# EAGLE design drv (EAGLE 9.1.0)
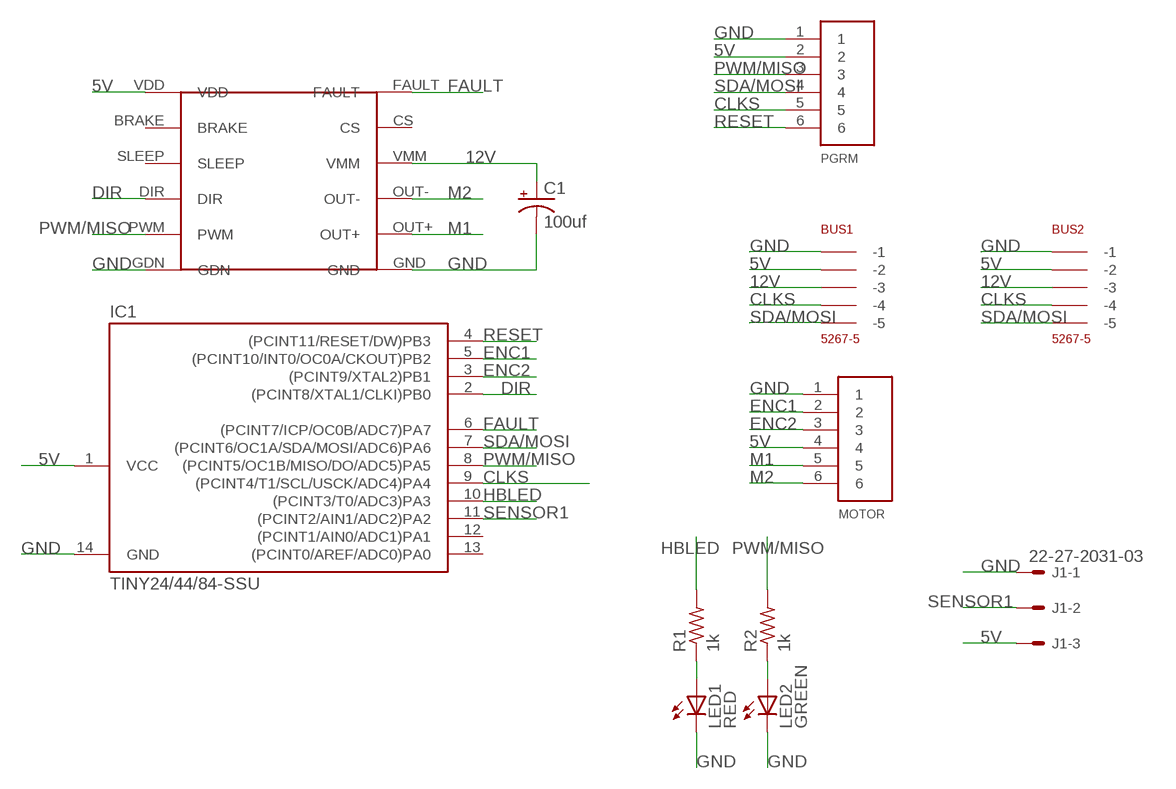
[diagram p0: schematic, sheet 1]

## Parts
BUS1  5267-5  [5267-5]
BUS2  5267-5  [5267-5]
C1  100uf  CPOL-USE5-10.5  [E5-10,5]
IC1  TINY24/44/84-SSU  [SOIC14]
J1  22-27-2031-03  [6410-03]
LED1  RED  LEDSMT1206  [1206]
LED2  GREEN  LEDSMT1206  [1206]
MOTOR  6PIN  [B6B-PH-K-S]
PGRM  6PIN  [B6B-PH-K-S]
R1  1k  R-US_M1206  [M1206]
R2  1k  R-US_M1206  [M1206]
U$1  DRV8801BR  [DRV8801BR]

## Nets
5V [pwr]: BUS1.P$2(-2) BUS2.P$2(-2) IC1.1(VCC) J1.3 MOTOR.4 PGRM.2 U$1.VDD
12V [pwr]: BUS1.P$3(-3) BUS2.P$3(-3) C1.+ U$1.VMM
CLKS: BUS1.P$4(-4) BUS2.P$4(-4) IC1.9((PCINT4/T1/SCL/USCK/ADC4)PA4) PGRM.5
DIR: IC1.2((PCINT8/XTAL1/CLKI)PB0) U$1.DIR
ENC1: IC1.5((PCINT10/INT0/OC0A/CKOUT)PB2) MOTOR.2
ENC2: IC1.3((PCINT9/XTAL2)PB1) MOTOR.3
FAULT: IC1.6((PCINT7/ICP/OC0B/ADC7)PA7) U$1.FAULT
GND [pwr]: BUS1.P$1(-1) BUS2.P$1(-1) C1.- IC1.14(GND) J1.1 LED1.C LED2.C MOTOR.1 PGRM.1 U$1.GDN U$1.GND
HBLED: IC1.10((PCINT3/T0/ADC3)PA3) R1.2
M1 [pwr]: MOTOR.5 U$1.OUT+
M2 [pwr]: MOTOR.6 U$1.OUT-
N$6: LED1.A R1.1
N$7: LED2.A R2.1
PWM/MISO: IC1.8((PCINT5/OC1B/MISO/DO/ADC5)PA5) PGRM.3 R2.2 U$1.PWM
RESET: IC1.4((PCINT11/RESET/DW)PB3) PGRM.6
SDA/MOSI: BUS1.P$5(-5) BUS2.P$5(-5) IC1.7((PCINT6/OC1A/SDA/MOSI/ADC6)PA6) PGRM.4
SENSOR1: IC1.11((PCINT2/AIN1/ADC2)PA2) J1.2
Unconnected: IC1.12((PCINT1/AIN0/ADC1)PA1) IC1.13((PCINT0/AREF/ADC0)PA0) U$1.BRAKE U$1.CS U$1.SLEEP

## Library data of the parts
BUS1 BUS2 = con-molex-spox:5267-5
C1 = rcl:CPOL-US: POLARIZED CAPACITOR, American symbol; SPICEPREFIX: C
IC1 = avr-7:TINY24/44/84
J1 = con-molex:22-?-03: CONNECTOR wire to board 2.54 mm (.1 inch) pitch header; MF: MOLEX; OC_FARNELL: unknown; OC_NEWARK: unknown
LED1 LED2 = led:LED: LED OSRAM: - CHIPLED LG R971, LG N971, LY N971, LG Q971, LY Q971, LO R971, LY R971 LH N974, LH R974 LS Q976, LO Q976, LY Q976 LO Q996 - Hyper CHIPLED LW Q18S LB Q993, LB Q99A, LB R99A - SideLED LS A670, LO A670, LY A670, LG A670, LP A670 LB A673, LV A673, LT A673, LW A673 LH A674 LY A675 LS A676, LA A676, LO A676, LY A676, LW A676 LS A679, LY A679, LG A679 - Hyper Micro SIDELED® LS Y876, LA Y876, LO Y876, LY Y876 LT Y87S - SmartLED LW L88C, LW L88S LB L89C, LB L89S, LG L890 LS L89K, LO L89K, LY L89K LS L896, LA L896, LO L896, LY L896 - TOPLED LS T670, LO T670, LY T670, LG T670, LP T670 LSG T670, LSP T670, LSY T670, LOP T670, LYG T670 LG T671, LOG T671, LSG T671 LB T673, LV T673, LT T673, LW T673 LH T674 LS T676, LA T676, LO T676, LY T676, LB T676, LH T676, LSB T676, LW T676 LB T67C, LV T67C, LT T67C, LS T67K, LO T67K, LY T67K, LW E67C LS E67B, LA E67B, LO E67B, LY E67B, LB E67C, LV E67C, LT E67C LW T67C LS T679, LY T679, LG T679 LS T770, LO T770, LY T770, LG T770, LP T770 LB T773, LV T773, LT T773, LW T773 LH T774 LS E675, LA E675, LY E675, LS T675 LS T776, LA T776, LO T776, LY T776, LB T776 LHGB T686 LT T68C, LB T68C - Hyper Mini TOPLED® LB M676 - Mini TOPLED Santana® LG M470 LS M47K, LO M47K, LY M47K Source: http://www.osram.convergy.de LUXEON: - LUMILED® LXK2-PW12-R00, LXK2-PW12-S00, LXK2-PW14-U00, LXK2-PW14-V00 LXK2-PM12-R00, LXK2-PM12-S00, LXK2-PM14-U00 LXK2-PE12-Q00, LXK2-PE12-R00, LXK2-PE12-S00, LXK2-PE14-T00, LXK2-PE14-U00 LXK2-PB12-K00, LXK2-PB12-L00, LXK2-PB12-M00, LXK2-PB14-N00, LXK2-PB14-P00, LXK2-PB14-Q00 LXK2-PR12-L00, LXK2-PR12-M00, LXK2-PR14-Q00, LXK2-PR14-R00 LXK2-PD12-Q00, LXK2-PD12-R00, LXK2-PD12-S00 LXK2-PH12-R00, LXK2-PH12-S00 LXK2-PL12-P00, LXK2-PL12-Q00, LXK2-PL12-R00 Source: www.luxeon.com KINGBRIGHT: KA-3528ASYC Source: www.kingbright.com
MOTOR PGRM = jst_eph:6PIN
R1 R2 = rcl:R-US_: RESISTOR, American symbol; SPICEPREFIX: R
U$1 = pololu:DRV8801BR

## Net classes
0 default: width 0.2 mm, clearance 0.1 mm
1 pwr: width 1 mm, clearance 0.25 mm
2 5v: width 0.4 mm, clearance 0.2 mm

## Board
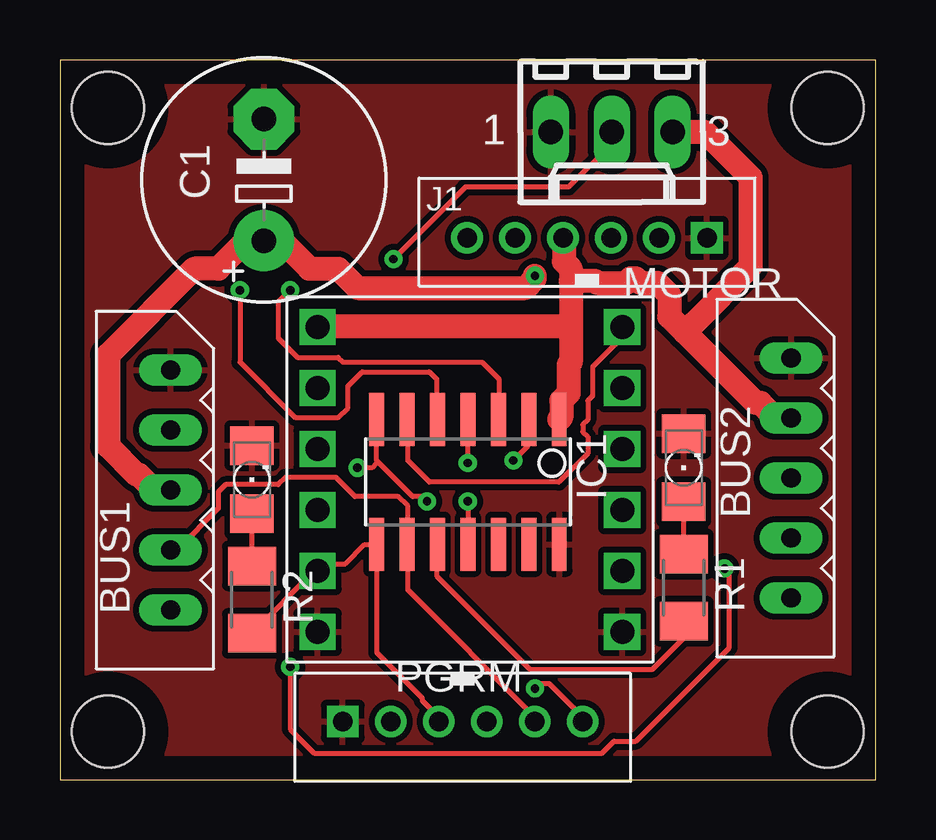
[diagram p1: board, top side]
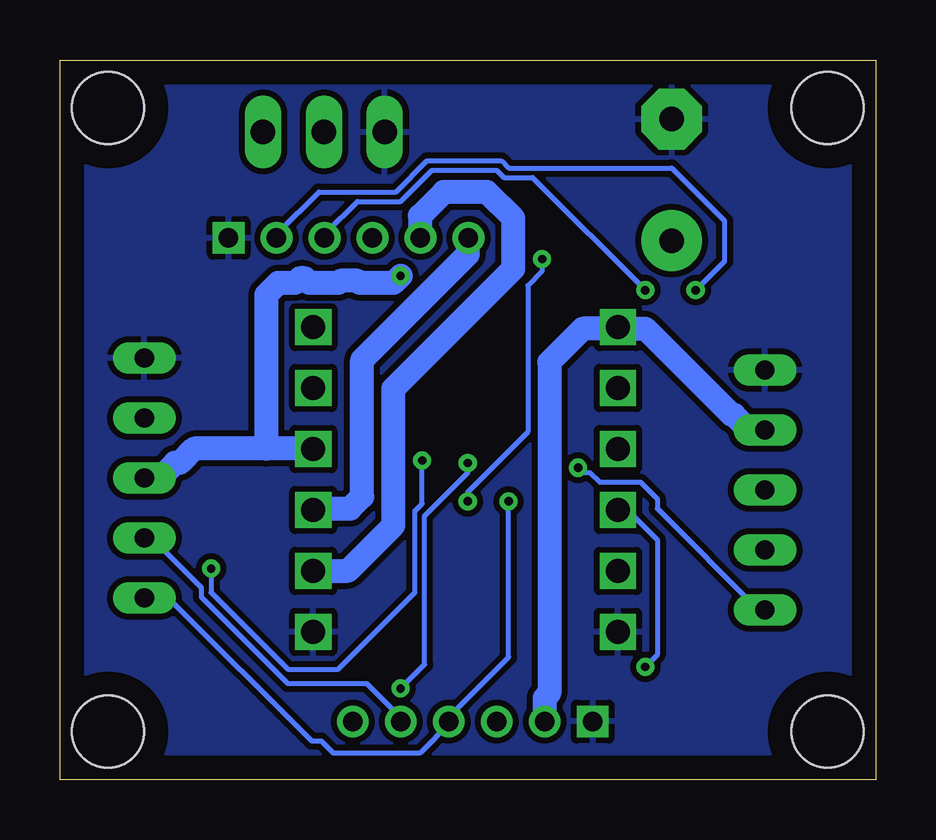
[diagram p2: board, bottom side, seen from below]

Size 34 x 30 mm. Coordinates in mm from the lower left corner, seen from the top.
Outline: 0,0 34,0 34,30 0,30 0,0
Copper layers (1*16): Top 0.035mm / dielectric 1.5mm / Bottom 0.035mm
Design rules "default *": minimum track width 6mil, minimum drill 0.35mm, track to track 0.2mm, track to pad 0.3mm, pad to pad 0.3mm, via to via 0.3mm, smd to smd 0.2mm, copper to edge 1mm, drill to drill 0.5mm, minimum pad ring 10mil, minimum via ring 8mil, stop-mask expansion 4mil, vias tented up to drill 0mil, thermal gap 10mil
Holes 3 mm at 2,2 2,28 32,2 32,28

### Footprints (pad centres in the part's own frame; a part is rotated, then mirrored left to right if it is on the bottom)
5267-5 = drill 0.8 long: P$1 0,0; P$2 2.5,0; P$3 5,0; P$4 7.5,0; P$5 10,0
E5-10,5 = drill 1.016 pad 2.54: + -2.54,0 | drill 1.016 pad 2.54 octagon: - 2.54,0
SOIC14 = smd 0.61 x 2.21: 1 -3.81,-2.603; 2 -2.54,-2.603; 3 -1.27,-2.603; 4 0,-2.603; 5 1.27,-2.603; 6 2.54,-2.603; 7 3.81,-2.603; 8 3.81,2.603; 9 2.54,2.603; 10 1.27,2.603; 11 0,2.603; 12 -1.27,2.603; 13 -2.54,2.603; 14 -3.81,2.603
6410-03 = drill 1.016 long: 1 2.54,0; 2 0,0; 3 -2.54,0
1206 = smd 1.6 x 1.803: A -1.422,0; C 1.422,0
B6B-PH-K-S = drill 0.813 square: 1 5,0 | drill 0.813: 2 3,0; 3 1,0; 4 -1,0; 5 -3,0; 6 -5,0
M1206 = smd 1.6 x 2: 1 -1.4,0; 2 1.4,0
DRV8801BR = drill 1 square: BRAKE 1.27,11.43; CS 13.97,11.43; DIR 1.27,6.35; FAULT 13.97,13.97; GDN 1.27,1.27; GND 13.97,1.27; OUT+ 13.97,3.81; OUT- 13.97,6.35; PWM 1.27,3.81; SLEEP 1.27,8.89; VDD 1.27,13.97; VMM 13.97,8.89

### Placement (x,y rotation side)
BUS1  4.61,17.07 270 top
BUS2  30.48,17.57 270 top
C1  8.5,25 90 top
IC1  17.01,12.41 180 top
J1  23,27 180 top
LED1  26,13 90 top
LED2  8,12.5 90 top
MOTOR  21.97,22.58 0 top
PGRM  16.79,2.42 180 top
R1  26,8 270 top
R2  8,7.5 270 top
U$1  9.47,4.89 0 top

### Tracks (layer width: path | path; a pad name or v marks a point on that pad's centre or on a via)
5V
  Top 1: 21.3,20.8 21.3,21.3 21,21.6 21,22.5 MOTOR.4 | 21.3,20.8 21.3,18.9 | 21.3,18.9 21.3,17.4 21.2,17.3 21.2,16.1 20.9,15.8 20.9,15.1 IC1.1 | 26.05,18.65 25.4,19.3 25.4,20.2 24.9,20.7 24.2,20.7 24,20.9 23.8,20.9 23.6,20.7 22.4,20.7 22.3,20.8 21.7,20.8 21.3,20.8 | 26.05,18.65 29,15.7 29.2,15.7 29.8,15.1 30.4,15.1 BUS2.P$2 | J1.3 25.6,27 26.9,27 28.8,25.1 28.8,21.4 26.4,19 26.05,18.65 | 21.3,18.9 20.9,18.9 10.8,18.9 U$1.VDD
  Bottom 1: BUS1.P$2 4.7,14.6 5.3,14.6 5.9,15.2 6,15.2 9.6,18.8 10.7,18.8 U$1.VDD 11.2,18.8 12.2,18.8 13.6,17.4 13.6,3.6 13.8,3.4 13.8,2.5 PGRM.2
12V  (via drill 0.35)
  Top 1: BUS1.P$3 4.6,12.1 3.9,12.1 3.3,12.7 3.2,12.7 2,13.9 2,17.7 5.6,21.3 6.6,21.3 7.7,22.4 8.5,22.4 C1.+ 8.9,22.3 9.4,22.3 10.4,21.3 11.6,21.3 12.4,20.5 19.4,20.5 19.8,20.9 v19.8,21
  Bottom 1: 25.4,13.8 23.5,13.8 U$1.VMM | 25.4,13.8 28.4,13.8 29,13.2 29.2,13.2 29.8,12.6 30.4,12.6 BUS2.P$3 | v19.8,21 20.1,20.7 21.5,20.7 21.6,20.8 22.3,20.8 22.4,20.7 23.6,20.7 23.8,20.9 24,20.9 24.2,20.7 24.9,20.7 25.4,20.2 25.4,14.2 25.4,13.8
CLKS
  Top 0.2: PGRM.5 19.7,2.5 19.7,2.7 14.5,7.9 14.5,9.8 IC1.9 14.5,9.9 14.5,11.4 14.1,11.8 12.3,11.8 11.5,12.6 9.4,12.6 9.1,12.3 6.9,12.3 6.6,12 6.6,11.3 4.9,9.6 4.7,9.6 BUS1.P$4
  Bottom 0.2: BUS2.P$4 30.4,10 30.1,10 28.1,8 28.1,7.6 24.5,4 21.2,4 19.7,2.5 PGRM.5
DIR  (via drill 0.35)
  Top 0.2: v18.9,13.3 19.5,13.9 19.5,15 IC1.2 | v27.7,8.8 27.9,8.6 27.9,5.5 24,1.6 23.1,1.6 22.6,1.1 10.6,1.1 9.6,2.1 v9.6,4.7
  Bottom 0.2: v18.9,13.3 18.9,11.5 19.2,11.2 19.2,7.8 22.4,4.6 24.5,4.6 27.7,7.8 v27.7,8.8 | v9.6,4.7 9.1,5.2 9.1,10 10.3,11.2 10.7,11.2 U$1.DIR
ENC1  (via drill 0.35)
  Top 0.2: v7.5,20.4 7.5,17.4 9.8,15.1 11.6,15.1 12,15.5 12,16.4 12.6,17 15.4,17 15.7,16.7 15.7,15.1 IC1.5
  Bottom 0.2: v7.5,20.4 6.3,21.6 6.3,23.3 8.5,25.5 15.3,25.5 15.6,25.8 18.7,25.8 20,24.5 23.2,24.5 24.9,22.8 24.9,22.6 MOTOR.2
ENC2  (via drill 0.35)
  Top 0.2: v9.6,20.4 9.1,19.9 9.1,18.4 9.9,17.6 11.6,17.6 11.8,17.4 17.6,17.4 18.3,16.7 18.3,15.1 IC1.3
  Bottom 0.2: v9.6,20.4 14.3,25.1 15.5,25.1 15.8,25.4 18.5,25.4 19.8,24.1 21.6,24.1 22.9,22.8 22.9,22.6 MOTOR.3
FAULT
  Top 0.2: IC1.6 14.5,15 14.5,13.3 15.4,12.4 20.8,12.4 22,13.6 22,14.3 21.8,14.5 21.8,14.8 22,15 22,15.8 22.2,16 22.2,17.2 23.4,18.4 23.4,18.8 U$1.FAULT
GND
  pour Bottom: -2,32.5 -2,-2.5 -1.5,-3 39.5,-3 41.5,-1 41.5,32.5
  pour Top: -2.5,33 -2.5,-2.5 36.5,-2.5 36.5,31.5
HBLED
  Top 0.2: R1.2 26,5.9 24.7,4.6 19.6,4.6 15.7,8.5 15.7,9.8 IC1.10
M1
  Bottom 1: MOTOR.5 19,22.6 19,23.5 18,24.5 16.2,24.5 15.1,23.4 15.1,21.3 20.1,16.3 20.1,10.6 22,8.7 23.4,8.7 U$1.OUT+
M2
  Bottom 1: MOTOR.6 17,22.5 17,21.9 21.4,17.5 21.4,11.8 21.9,11.3 23.4,11.3 U$1.OUT-
N$6
  Top 0.2: R1.1 26,11.5 LED1.A
N$7
  Top 0.2: R2.1 8,11 LED2.A
PWM/MISO
  Top 0.2: R2.2 10.6,8.7 10.7,8.7 U$1.PWM 10.8,8.7 11.1,9 11.9,9 12.7,9.8 IC1.8 | IC1.8 | IC1.8 13.2,5.3 15.1,3.4 15.1,3.3 15.7,2.7 15.7,2.5 PGRM.3
RESET  (via drill 0.35)
  Top 0.2: v17,13.2 IC1.4 | v19.8,3.8 20,4 20.4,4 21.7,2.7 21.7,2.5 PGRM.6
  Bottom 0.2: v17,13.2 17,12.8 18.8,11 18.8,4.8 v19.8,3.8
SDA/MOSI  (via drill 0.35)
  Top 0.2: 13.25,13.25 14.7,11.8 15.1,11.8 v15.3,11.6 | 13.25,13.25 13.2,13.3 IC1.7 | v12.4,13 13,13 13.2,13.2 13.25,13.25
  Bottom 0.2: v15.3,11.6 15.3,5.1 17.7,2.7 17.7,2.5 PGRM.4 17.7,2.4 19,1.1 22.6,1.1 23.1,1.6 23.5,1.6 29.4,7.5 30.4,7.5 BUS2.P$5 | v12.4,13 12.2,12.8 11.9,12.8 11.5,12.4 9.8,12.4 9.1,11.7 9.1,11.3 4.9,7.1 4.7,7.1 BUS1.P$5
SENSOR1  (via drill 0.35)
  Top 0.2: v17,11.6 17,9.9 IC1.11 | v13.9,21.7 16.9,24.7 21.2,24.7 23,26.5 J1.2
  Bottom 0.2: v17,11.6 17,12 14.5,14.5 14.5,20.6 13.9,21.2 v13.9,21.7

### Text on the board
tValues: GND | GND | GND | GND